# EAGLE schematic hello-ftdi-44 (EAGLE 8.0.1)
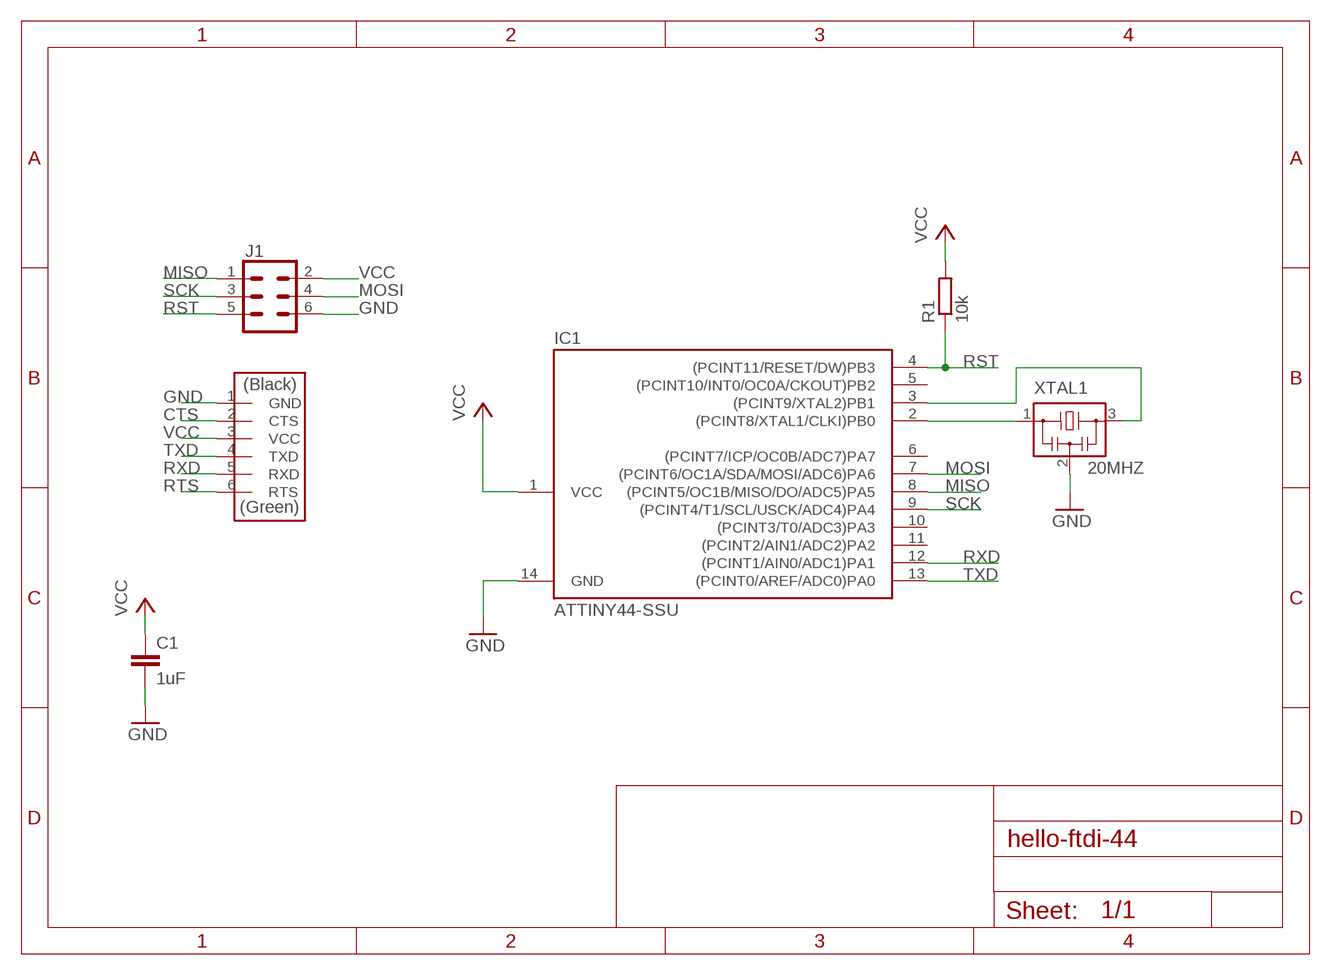
[diagram p0: schematic, sheet 1]

## Parts
C1  1uF  C-EUC1206  [C1206]
IC1  ATTINY44-SSU  [SOIC14]
J1  CONN_03X2SMT  [2X3_SMT_POSTS]
J2  FTDI-SMD-HEADER  [1X06SMD]
R1  10k  R-EU_M1206  [M1206]
XTAL1  20MHZ  RESONATOR  [EFOBM]

## Nets
CTS: J2.2(CTS)
GND: C1.2 IC1.14(GND) J1.6 J2.1(GND) XTAL1.2
MISO: IC1.8((PCINT5/OC1B/MISO/DO/ADC5)PA5) J1.1
MOSI: IC1.7((PCINT6/OC1A/SDA/MOSI/ADC6)PA6) J1.4
N$7: IC1.2((PCINT8/XTAL1/CLKI)PB0) XTAL1.1
N$8: IC1.3((PCINT9/XTAL2)PB1) XTAL1.3
RST: IC1.4((PCINT11/RESET/DW)PB3) J1.5 R1.1
RTS: J2.6(RTS)
RXD: IC1.12((PCINT1/AIN0/ADC1)PA1) J2.5(RXD)
SCK: IC1.9((PCINT4/T1/SCL/USCK/ADC4)PA4) J1.3
TXD: IC1.13((PCINT0/AREF/ADC0)PA0) J2.4(TXD)
VCC: C1.1 IC1.1(VCC) J1.2 J2.3(VCC) R1.2
Unconnected: IC1.5((PCINT10/INT0/OC0A/CKOUT)PB2) IC1.6((PCINT7/ICP/OC0B/ADC7)PA7) IC1.10((PCINT3/T0/ADC3)PA3) IC1.11((PCINT2/AIN1/ADC2)PA2)

## Library data of the parts
C1 = rcl:C-EU: CAPACITOR, European symbol
IC1 = fab:ATTINY44
J1 = SparkFun-Connectors:CONN_03X2: Multi connection point. Often used as Generic Header-pin footprint for 0.1 inch spaced/style header connections You can populate with any combo of single row headers, but if you'd like an exact match, check these: Header - 2x3 (Male, 0.1") <https://www.sparkfun.com/products/12807> (PRT-12807) Header - 2x3 (Female, 0.1") <https://www.sparkfun.com/products/13010> (PRT-13010) 2x3 Pin Shrouded Header <https://www.sparkfun.com/products/10877> (PRT-10877) On any of the 0.1 inch spaced packages, you can populate with these: Break Away Headers - Straight <https://www.sparkfun.com/products/116> (PRT-00116) Break Away Male Headers - Right Angle <https://www.sparkfun.com/products/553> (PRT-00553) Female Headers <https://www.sparkfun.com/products/115> (PRT-00115) Break Away Headers - Machine Pin <https://www.sparkfun.com/products/117> (PRT-00117) Break Away Female Headers - Swiss Machine Pin <https://www.sparkfun.com/products/743> (PRT-00743) Special note: the shrouded connector mates well with our 3x2 ribbon cables: Ribbon Crimp Connector - 6-pin (2x3, Female) <https://www.sparkfun.com/products/10651> (PRT-10651) Ribbon Cable - 6 wire (15ft) <https://www.sparkfun.com/products/10646> (PRT-10646); PROD_ID: CONN-11415
J2 = fab:FTDI-SMD-HEADER
R1 = rcl:R-EU_: RESISTOR, European symbol
XTAL1 = fab:RESONATOR